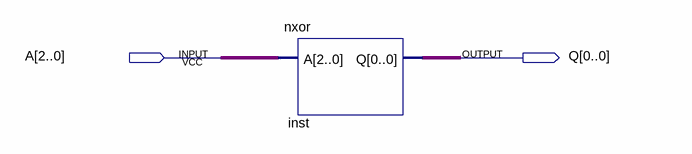
[diagram p0: schematic sheet]
// Quartus schematic Block1.bdf as structural Verilog: 1 symbols, 2 pins
module Block1 (
  input  [2:0] A,
  output [0:0] Q
);

  nxor inst (.A(A), .Q(Q[0]));
endmodule
